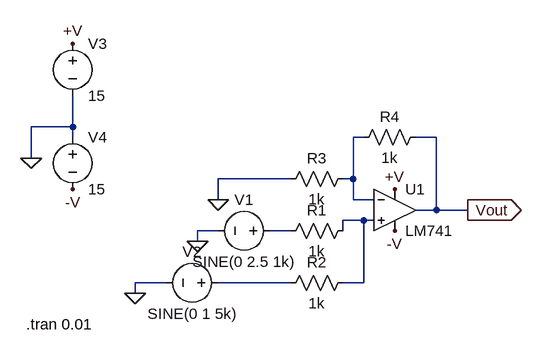
[diagram p0: schematic adder.asc]
adder.asc, the LTspice schematic file:
Version 4
SHEET 1 880 680
WIRE -272 32 -272 -16
WIRE -272 32 -336 32
WIRE -272 48 -272 32
WIRE 176 48 160 48
WIRE 288 48 256 48
WIRE -336 80 -336 32
WIRE 64 112 -48 112
WIRE 160 112 160 48
WIRE 160 112 144 112
WIRE -48 144 -48 112
WIRE 160 144 160 112
WIRE 192 144 160 144
WIRE 288 160 288 48
WIRE 288 160 256 160
WIRE 336 160 288 160
WIRE 176 176 144 176
WIRE 192 176 176 176
WIRE -48 192 -80 192
WIRE 64 192 32 192
WIRE 144 192 144 176
WIRE -80 208 -80 192
WIRE -128 272 -176 272
WIRE 64 272 -48 272
WIRE 176 272 176 176
WIRE 176 272 144 272
WIRE -176 288 -176 272
FLAG -48 144 0
FLAG -80 208 0
FLAG -176 288 0
FLAG -336 80 0
FLAG -272 -96 +V
FLAG -272 128 -V
FLAG 224 128 +V
FLAG 224 192 -V
FLAG 336 160 Vout
IOPIN 336 160 Out
SYMBOL LM741 224 96 R0
SYMATTR InstName U1
SYMBOL res 160 176 R90
WINDOW 0 0 56 VBottom 2
WINDOW 3 32 56 VTop 2
SYMATTR InstName R1
SYMATTR Value 1k
SYMBOL res 160 256 R90
WINDOW 0 0 56 VBottom 2
WINDOW 3 32 56 VTop 2
SYMATTR InstName R2
SYMATTR Value 1k
SYMBOL res 160 96 R90
WINDOW 0 0 56 VBottom 2
WINDOW 3 32 56 VTop 2
SYMATTR InstName R3
SYMATTR Value 1k
SYMBOL res 272 32 R90
WINDOW 0 0 56 VBottom 2
WINDOW 3 32 56 VTop 2
SYMATTR InstName R4
SYMATTR Value 1k
SYMBOL voltage 48 192 R90
WINDOW 0 -32 56 VBottom 2
WINDOW 3 32 56 VTop 2
WINDOW 123 0 0 Left 0
WINDOW 39 0 0 Left 0
SYMATTR InstName V1
SYMATTR Value SINE(0 2.5 1k)
SYMBOL voltage -32 272 R90
WINDOW 0 -32 56 VBottom 2
WINDOW 3 32 56 VTop 2
WINDOW 123 0 0 Left 0
WINDOW 39 0 0 Left 0
SYMATTR InstName V2
SYMATTR Value SINE(0 1 5k)
SYMBOL voltage -272 -112 R0
WINDOW 123 0 0 Left 0
WINDOW 39 0 0 Left 0
SYMATTR InstName V3
SYMATTR Value 15
SYMBOL voltage -272 32 R0
WINDOW 123 0 0 Left 0
WINDOW 39 0 0 Left 0
SYMATTR InstName V4
SYMATTR Value 15
TEXT -344 336 Left 2 !.tran 0.01

The netlist it stands for:
* adder.asc
XU1 N002 N001 +V -V Vout LM741  ; pins In+ In- V+ V- OUT
R1 N002 N003 1k
R2 N002 N004 1k
R3 N001 0 1k
R4 Vout N001 1k
V1 N003 0 SINE(0 2.5 1k)
V2 N004 0 SINE(0 1 5k)
V3 +V 0 15
V4 0 -V 15
.tran 0.01
.lib LM741.lib
.backanno
.end